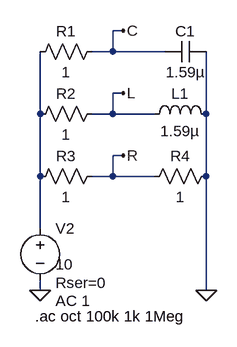
[diagram p0: schematic RLC.asc]
RLC.asc, the LTspice schematic file:
Version 4
SHEET 1 1248 680
WIRE -304 -384 -320 -384
WIRE -320 -352 -320 -384
WIRE -320 -352 -352 -352
WIRE -240 -352 -320 -352
WIRE -304 -288 -320 -288
WIRE -432 -256 -432 -352
WIRE -320 -256 -320 -288
WIRE -320 -256 -352 -256
WIRE -256 -256 -320 -256
WIRE -176 -256 -176 -352
WIRE -304 -192 -320 -192
WIRE -432 -160 -432 -256
WIRE -320 -160 -320 -192
WIRE -320 -160 -352 -160
WIRE -256 -160 -320 -160
WIRE -176 -160 -176 -256
WIRE -432 -80 -432 -160
WIRE -432 16 -432 0
WIRE -176 16 -176 -160
FLAG -432 16 0
FLAG -176 16 0
FLAG -304 -384 C
FLAG -304 -288 L
FLAG -304 -192 R
SYMBOL voltage -432 -96 R0
WINDOW 3 24 72 Left 2
WINDOW 39 24 100 Left 2
WINDOW 123 24 128 Left 2
SYMATTR Value 10
SYMATTR SpiceLine Rser=0
SYMATTR Value2 AC 1
SYMATTR InstName V2
SYMBOL res -336 -368 R90
WINDOW 0 0 56 VBottom 2
WINDOW 3 32 56 VTop 2
SYMATTR InstName R1
SYMATTR Value 1
SYMBOL res -336 -272 R90
WINDOW 0 0 56 VBottom 2
WINDOW 3 32 56 VTop 2
SYMATTR InstName R2
SYMATTR Value 1
SYMBOL cap -176 -368 R90
WINDOW 0 0 32 VBottom 2
WINDOW 3 32 32 VTop 2
SYMATTR InstName C1
SYMATTR Value 1.59µ
SYMBOL ind -272 -240 R270
WINDOW 0 32 56 VTop 2
WINDOW 3 5 56 VBottom 2
SYMATTR InstName L1
SYMATTR Value 1.59µ
SYMBOL res -336 -176 R90
WINDOW 0 0 56 VBottom 2
WINDOW 3 32 56 VTop 2
SYMATTR InstName R3
SYMATTR Value 1
SYMBOL res -160 -176 R90
WINDOW 0 0 56 VBottom 2
WINDOW 3 32 56 VTop 2
SYMATTR InstName R4
SYMATTR Value 1
TEXT -440 56 Left 2 !.ac oct 100k 1k 1Meg

The netlist it stands for:
* RLC.asc
V2 N001 0 10 AC 1 Rser=0
R1 C N001 1
R2 L N001 1
C1 0 C 1.59µ
L1 L 0 1.59µ
R3 R N001 1
R4 0 R 1
.ac oct 100k 1k 1Meg
.backanno
.end